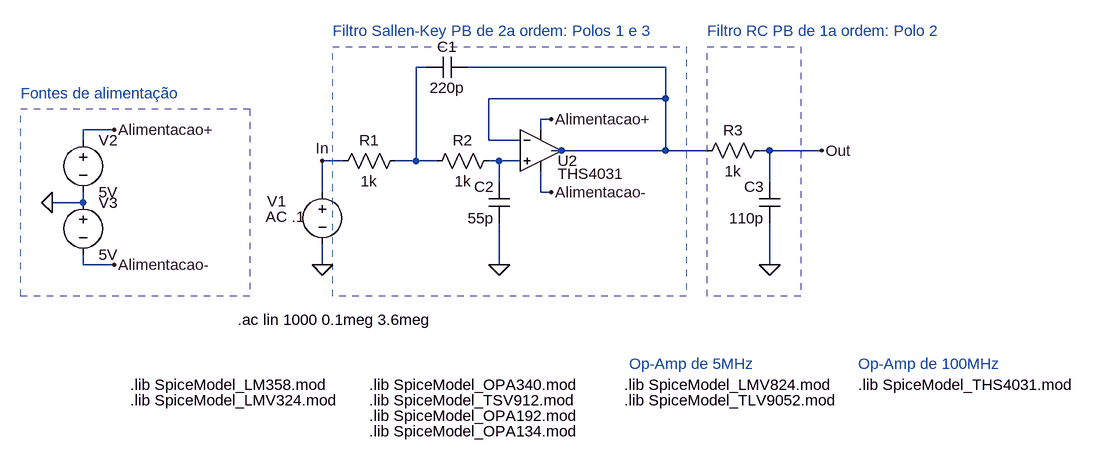
[diagram p0: schematic FiltroButterworth_(LTspice).asc]
FiltroButterworth_(LTspice).asc, the LTspice schematic file:
Version 4
SHEET 1 1132 680
WIRE -80 -96 -96 -96
WIRE 288 -96 -16 -96
WIRE 288 -48 288 -96
WIRE 288 -48 16 -48
WIRE 112 -16 96 -16
WIRE -560 0 -608 0
WIRE 96 0 96 -16
WIRE -608 16 -608 0
WIRE 16 16 16 -48
WIRE 64 16 16 16
WIRE 128 32 112 32
WIRE 288 32 288 -48
WIRE 288 32 128 32
WIRE 352 32 288 32
WIRE 448 32 432 32
WIRE 528 32 448 32
WIRE -208 48 -240 48
WIRE -96 48 -96 -96
WIRE -96 48 -128 48
WIRE -64 48 -96 48
WIRE 32 48 16 48
WIRE 64 48 32 48
WIRE 32 80 32 48
WIRE 448 80 448 32
WIRE -240 96 -240 48
WIRE 96 96 96 64
WIRE 112 96 96 96
WIRE -608 112 -608 96
WIRE -608 112 -656 112
WIRE -608 208 -608 192
WIRE -560 208 -608 208
WIRE -240 208 -240 176
WIRE 32 208 32 144
WIRE 448 208 448 144
FLAG -240 208 0
FLAG -656 112 0
FLAG -560 0 Alimentacao+
FLAG -560 208 Alimentacao-
FLAG 448 208 0
FLAG 112 -16 Alimentacao+
FLAG 112 96 Alimentacao-
FLAG 32 208 0
FLAG 528 32 Out
FLAG -240 48 In
SYMBOL voltage -240 80 R0
WINDOW 123 -87 54 Left 2
WINDOW 39 0 0 Left 0
WINDOW 0 -85 30 Left 2
WINDOW 3 -106 99 Left 2
SYMATTR Value2 AC .1
SYMATTR InstName V1
SYMATTR Value ""
SYMBOL res -112 32 R90
WINDOW 0 0 56 VBottom 2
WINDOW 3 32 56 VTop 2
SYMATTR InstName R1
SYMATTR Value 1k
SYMBOL voltage -608 0 R0
WINDOW 123 0 0 Left 0
WINDOW 39 0 0 Left 0
SYMATTR InstName V2
SYMATTR Value 5V
SYMBOL voltage -608 96 R0
WINDOW 123 0 0 Left 0
WINDOW 39 0 0 Left 0
SYMATTR InstName V3
SYMATTR Value 5V
SYMBOL cap -16 -112 R90
WINDOW 0 0 32 VBottom 2
WINDOW 3 32 32 VTop 2
SYMATTR InstName C1
SYMATTR Value 220p
SYMBOL Opamps\\opamp2 96 -32 R0
WINDOW 0 26 80 Left 2
WINDOW 3 26 100 Left 2
SYMATTR InstName U2
SYMATTR Value THS4031
SYMBOL res 32 32 R90
WINDOW 0 0 56 VBottom 2
WINDOW 3 32 56 VTop 2
SYMATTR InstName R2
SYMATTR Value 1k
SYMBOL res 448 16 R90
WINDOW 0 0 56 VBottom 2
WINDOW 3 32 56 VTop 2
SYMATTR InstName R3
SYMATTR Value 1k
SYMBOL cap 48 144 R180
WINDOW 0 24 56 Left 2
WINDOW 3 24 8 Left 2
SYMATTR InstName C2
SYMATTR Value 55p
SYMBOL cap 464 144 R180
WINDOW 0 24 56 Left 2
WINDOW 3 24 8 Left 2
SYMATTR InstName C3
SYMATTR Value 110p
TEXT -536 392 Left 2 !.lib SpiceModel_LM358.mod
TEXT -704 -56 Left 2 ;Fontes de alimentação
TEXT -224 -152 Left 2 ;Filtro Sallen-Key PB de 2a ordem: Polos 1 e 3
TEXT 352 -152 Left 2 ;Filtro RC PB de 1a ordem: Polo 2
TEXT -370 292 Left 2 !.ac lin 1000 0.1meg 3.6meg
TEXT -168 392 Left 2 !.lib SpiceModel_OPA340.mod
TEXT -168 416 Left 2 !.lib SpiceModel_TSV912.mod
TEXT -168 440 Left 2 !.lib SpiceModel_OPA192.mod
TEXT -168 464 Left 2 !.lib SpiceModel_OPA134.mod
TEXT -536 416 Left 2 !.lib SpiceModel_LMV324.mod
TEXT 224 392 Left 2 !.lib SpiceModel_LMV824.mod
TEXT 224 416 Left 2 !.lib SpiceModel_TLV9052.mod
TEXT 584 392 Left 2 !.lib SpiceModel_THS4031.mod
TEXT 232 360 Left 2 ;Op-Amp de 5MHz
TEXT 584 360 Left 2 ;Op-Amp de 100MHz
RECTANGLE Normal -352 256 -704 -32 2
RECTANGLE Normal 320 256 -224 -128 2
RECTANGLE Normal 496 256 352 -128 2

The netlist it stands for:
* FiltroButterworth_(LTspice).asc
V1 In 0 AC .1
R1 N001 In 1k
V2 Alimentacao+ 0 5V
V3 0 Alimentacao- 5V
C1 N002 N001 220p
XU2 N003 N002 Alimentacao+ Alimentacao- N002 THS4031  ; pins In+ In- V+ V- OUT
R2 N003 N001 1k
R3 Out N002 1k
C2 0 N003 55p
C3 0 Out 110p
.lib SpiceModel_LM358.mod
* Fontes de alimentação
* Filtro Sallen-Key PB de 2a ordem: Polos 1 e 3
* Filtro RC PB de 1a ordem: Polo 2
.ac lin 1000 0.1meg 3.6meg
.lib SpiceModel_OPA340.mod
.lib SpiceModel_TSV912.mod
.lib SpiceModel_OPA192.mod
.lib SpiceModel_OPA134.mod
.lib SpiceModel_LMV324.mod
.lib SpiceModel_LMV824.mod
.lib SpiceModel_TLV9052.mod
.lib SpiceModel_THS4031.mod
* Op-Amp de 5MHz
* Op-Amp de 100MHz
.backanno
.end